# EAGLE design Project-PowerSwitch-Final (EAGLE 7.2.0)

## Sheet 1 of 3
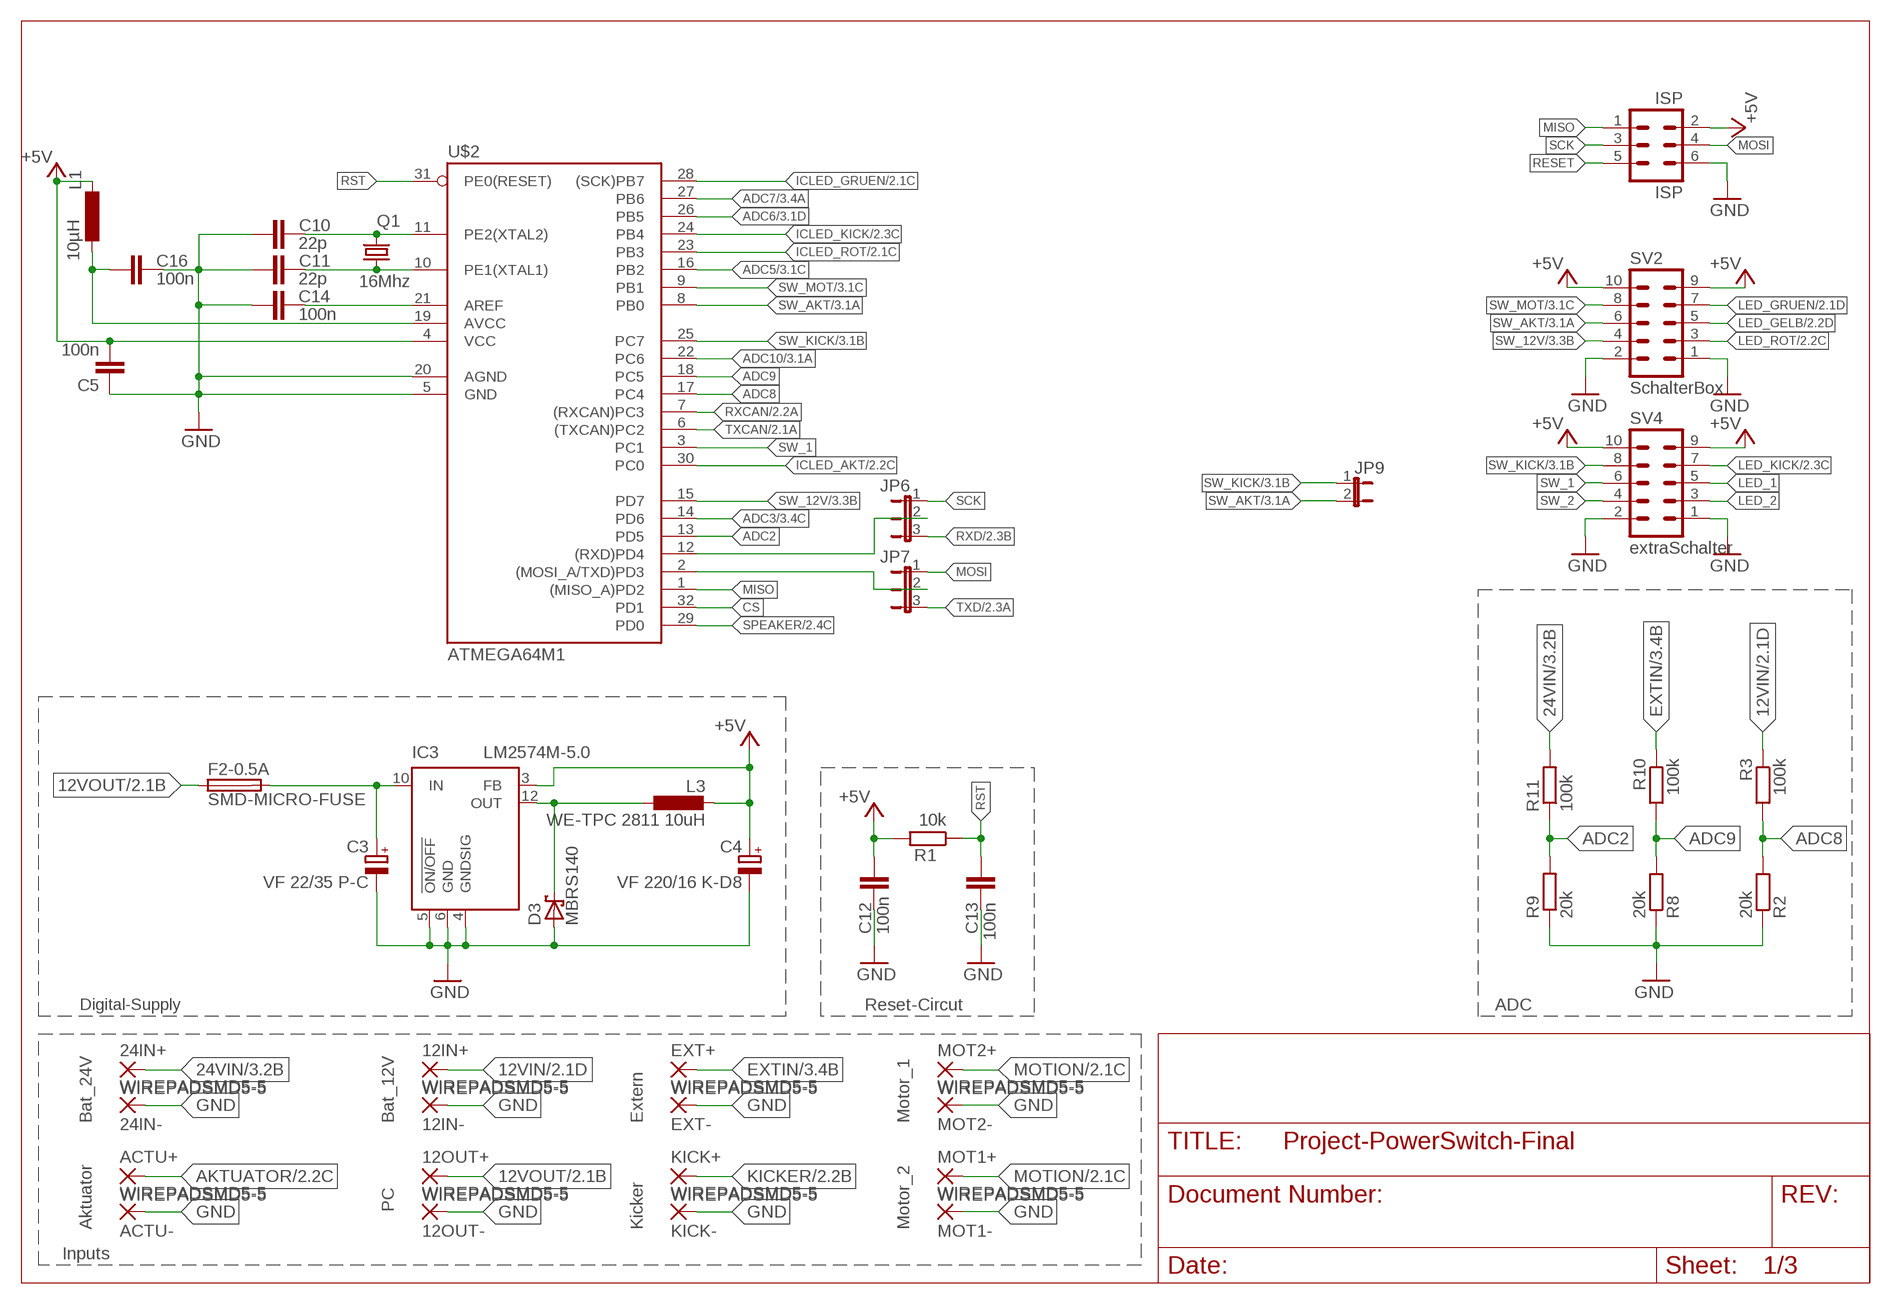
[diagram p0: schematic, sheet 1]

### Parts
12IN+  WIREPADSMD5-5  [5-5]
12IN-  WIREPADSMD5-5  [5-5]
12OUT+  WIREPADSMD5-5  [5-5]
12OUT-  WIREPADSMD5-5  [5-5]
24IN+  WIREPADSMD5-5  [5-5]
24IN-  WIREPADSMD5-5  [5-5]
ACTU+  WIREPADSMD5-5  [5-5]
ACTU-  WIREPADSMD5-5  [5-5]
C3  VF 22/35 P-C  CPOL-EUC  [PANASONIC_C]
C4  VF 220/16 K-D8  CPOL-EUD  [PANASONIC_D]
C5  100n  C-EUC0603K  [C0603K]
C10  22p  C-EUC0603K  [C0603K]
C11  22p  C-EUC0603K  [C0603K]
C12  100n  C-EUC0603K  [C0603K]
C13  100n  C-EUC0603K  [C0603K]
C14  100n  C-EUC0603K  [C0603K]
C16  100n  C-EUC0603K  [C0603K]
D3  MBRS140  SCHOTTKY-DIODESMD  [SMB]
EXT+  WIREPADSMD5-5  [5-5]
EXT-  WIREPADSMD5-5  [5-5]
F2-0.5A  SMD-MICRO-FUSE  [SMD-6,1X2,6]
IC3  LM2574M-5.0  [SO14W]
ISP  ISP  ML6  [ML6]
JP6  JP2E  [JP2]
JP7  JP2E  [JP2]
JP9  JP1E  [JP1]
KICK+  WIREPADSMD5-5  [5-5]
KICK-  WIREPADSMD5-5  [5-5]
L1  10µH  L-EU-0805L0805  [R0805]
L3  WE-TPC 2811 10uH  L-EUWE-TPC  [POWER-CHOKE_WE-TPC]
MOT1+  WIREPADSMD5-5  [5-5]
MOT1-  WIREPADSMD5-5  [5-5]
MOT2+  WIREPADSMD5-5  [5-5]
MOT2-  WIREPADSMD5-5  [5-5]
Q1  16Mhz  CRYTALHC49U-V  [HC49U-V@1]
R1  10k  R-EU_R0805  [R0805]
R2  20k  R-EU_R0805  [R0805]
R3  100k  R-EU_R0805  [R0805]
R8  20k  R-EU_R0805  [R0805]
R9  20k  R-EU_R0805  [R0805]
R10  100k  R-EU_R0805  [R0805]
R11  100k  R-EU_R0805  [R0805]
SV2  SchalterBox  ML10  [ML10]
SV4  extraSchalter  ML10  [ML10]
U$2  ATMEGA64M1  [TQFP32-08]

### Nets
12VIN: 12IN+.P$1(P) R3.1 ; also sheet 2,3
12VOUT: 12OUT+.P$1(P) F2-0.5A.1 ; also sheet 2,3
24VIN: 24IN+.P$1(P) R11.2 ; also sheet 3
+5V: C4.+ C5.2 C12.2 IC3.3(FB) ISP.2 L1.2 L3.2 R1.2 SV2.9 SV2.10 SV4.9 SV4.10 U$2.4(VCC) ; also sheet 2
ADC2: R9.2 R11.1 U$2.13(PD5)
ADC3: U$2.14(PD6) ; also sheet 3
ADC5: U$2.16(PB2) ; also sheet 3
ADC6: U$2.26(PB5) ; also sheet 3
ADC7: U$2.27(PB6) ; also sheet 3
ADC8: R2.2 R3.2 U$2.17(PC4)
ADC9: R8.2 R10.2 U$2.18(PC5)
ADC10: U$2.22(PC6) ; also sheet 3
AKTUATOR: ACTU+.P$1(P) ; also sheet 2,3
CS: U$2.32(PD1)
EXTIN: EXT+.P$1(P) R10.1 ; also sheet 3
GND: 12IN-.P$1(P) 12OUT-.P$1(P) 24IN-.P$1(P) ACTU-.P$1(P) C3.- C4.- C5.1 C10.1 C11.1 C12.1 C13.1 C14.1 C16.2 D3.A EXT-.P$1(P) IC3.4(GNDSIG) IC3.5(!ON/OFF) IC3.6(GND) ISP.6 KICK-.P$1(P) MOT1-.P$1(P) MOT2-.P$1(P) R2.1 R8.1 R9.1 SV2.1 SV2.2 SV4.1 SV4.2 U$2.5(GND) U$2.20(AGND) ; also sheet 2,3
ICLED_AKT: U$2.30(PC0) ; also sheet 2
ICLED_GRUEN: U$2.28((SCK)PB7) ; also sheet 2
ICLED_KICK: U$2.24(PB4) ; also sheet 2
ICLED_ROT: U$2.23(PB3) ; also sheet 2
KICKER: KICK+.P$1(P) ; also sheet 2,3
LED_1: SV4.5
LED_2: SV4.3
LED_GELB: SV2.5 ; also sheet 2
LED_GRUEN: SV2.7 ; also sheet 2
LED_KICK: SV4.7 ; also sheet 2
LED_ROT: SV2.3 ; also sheet 2
MISO: ISP.1 U$2.1((MISO_A)PD2)
MOSI: ISP.4 JP7.1
MOTION: MOT1+.P$1(P) MOT2+.P$1(P) ; also sheet 2,3
N$10: C10.2 Q1.2 U$2.11(PE2(XTAL2))
N$11: C11.2 Q1.1 U$2.10(PE1(XTAL1))
N$13: C14.2 U$2.21(AREF)
N$14: C16.1 L1.1 U$2.19(AVCC)
N$16: JP6.2 U$2.12((RXD)PD4)
N$17: JP7.2 U$2.2((MOSI_A/TXD)PD3)
N$22: C3.+ F2-0.5A.2 IC3.10(IN)
N$64: D3.C IC3.12(OUT) L3.1
RESET: ISP.5
RST: C13.2 R1.1 U$2.31(PE0(RESET))
RXCAN: U$2.7((RXCAN)PC3) ; also sheet 2
RXD: JP6.3 ; also sheet 2
SCK: ISP.3 JP6.1
SPEAKER: U$2.29(PD0) ; also sheet 2
SW_1: SV4.6 U$2.3(PC1)
SW_2: SV4.4
SW_12V: SV2.4 U$2.15(PD7) ; also sheet 3
SW_AKT: JP9.2 SV2.6 U$2.8(PB0) ; also sheet 3
SW_KICK: JP9.1 SV4.8 U$2.25(PC7) ; also sheet 3
SW_MOT: SV2.8 U$2.9(PB1) ; also sheet 3
TXCAN: U$2.6((TXCAN)PC2) ; also sheet 2
TXD: JP7.3 ; also sheet 2

### Notes on the sheet
- Digital-Supply | Reset-Circut | ADC
- Bat_24V | Bat_12V | Extern | Motor_1
- PC
- Aktuator | Kicker | Motor_2
- Inputs

## Sheet 2 of 3
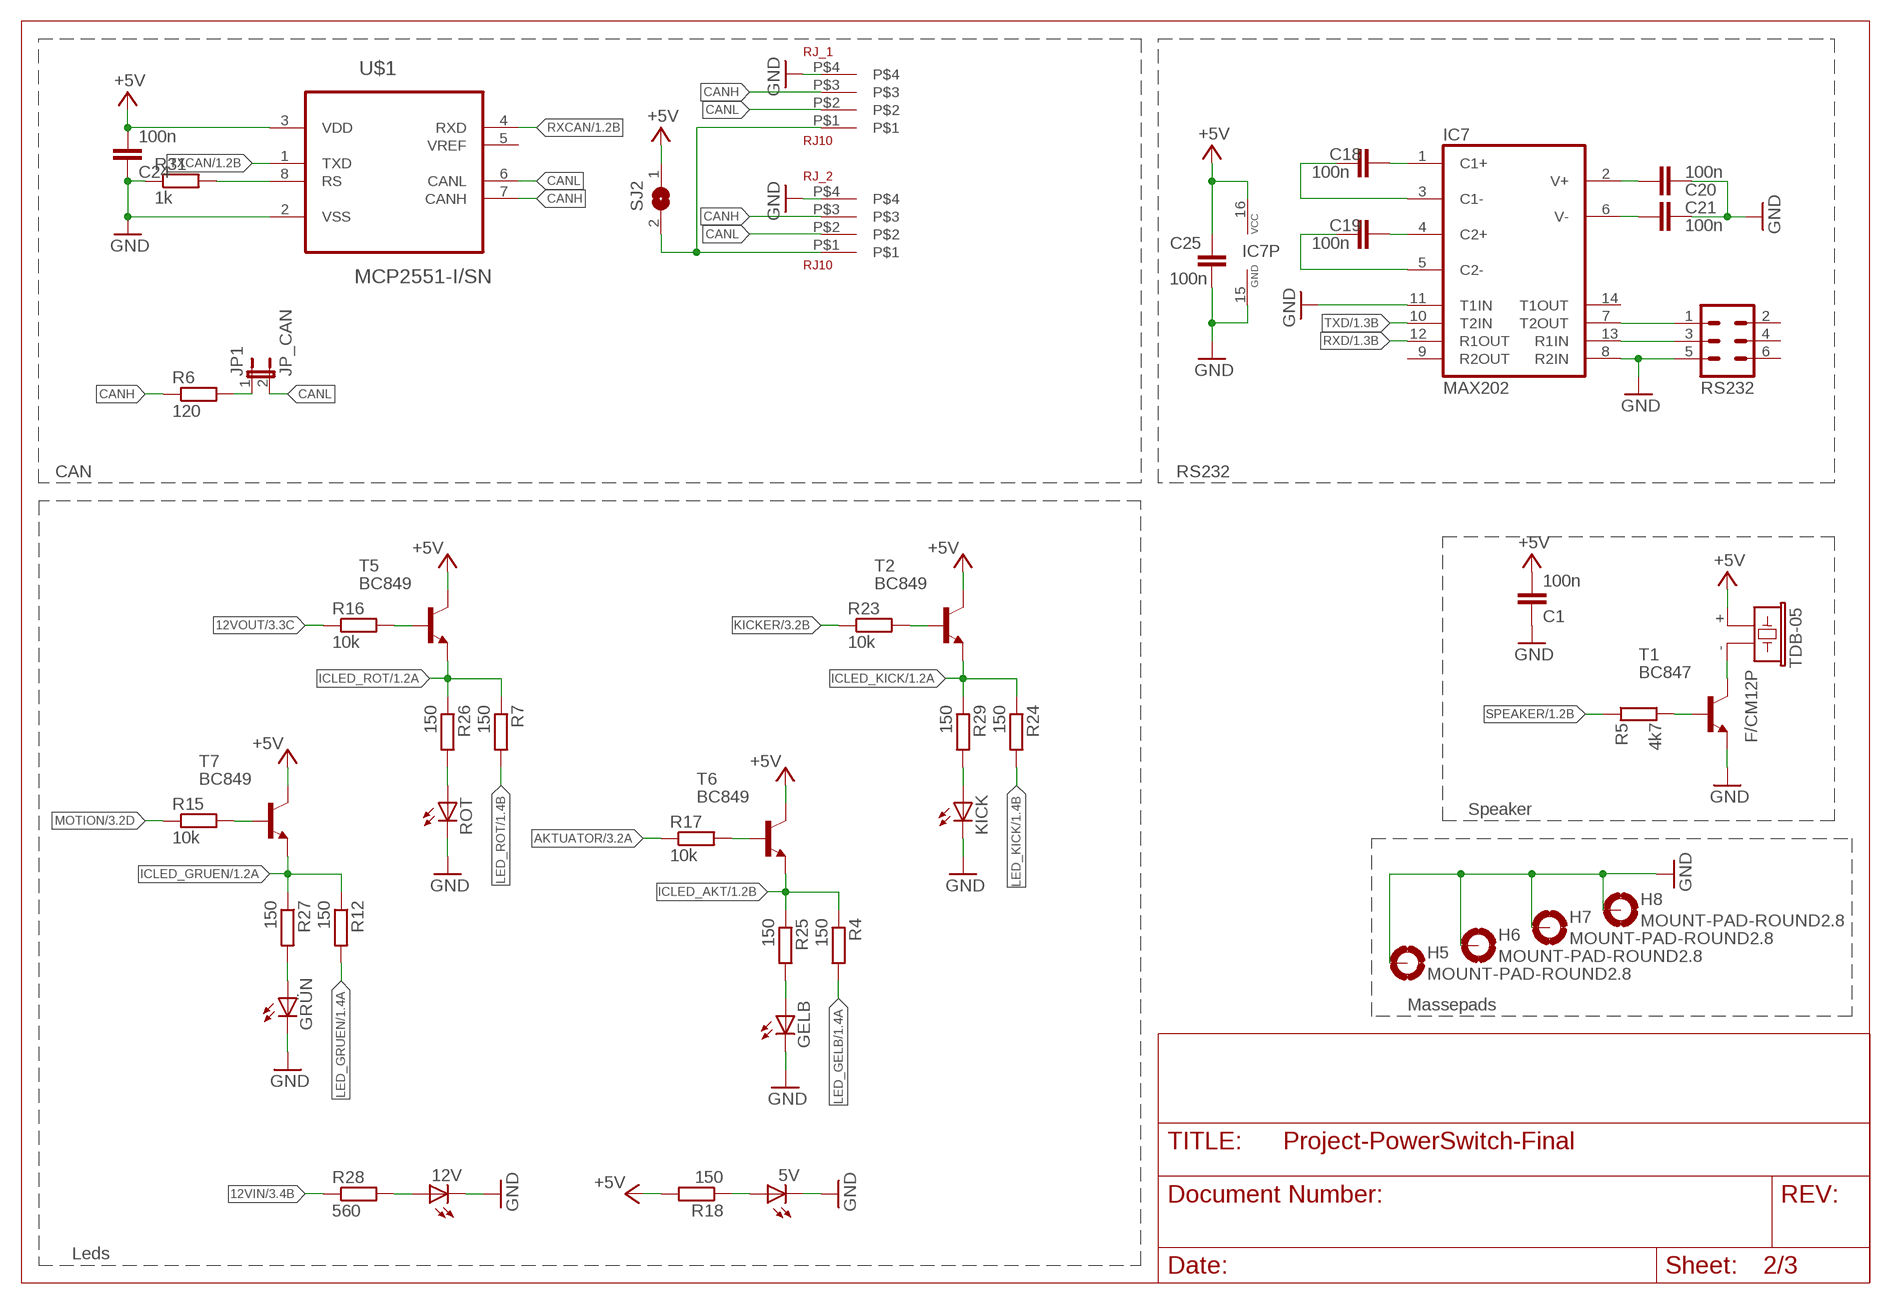
[diagram p1: schematic, sheet 2]

### Parts
5V  LEDCHIPLED_0805  [CHIPLED_0805]
12V  LEDCHIPLED_0805  [CHIPLED_0805]
C1  100n  C-EUC0603  [C0603]
C18  100n  C-EUC0603K  [C0603K]
C19  100n  C-EUC0603K  [C0603K]
C20  100n  C-EUC0603K  [C0603K]
C21  100n  C-EUC0603K  [C0603K]
C24  100n  C-EUC0603  [C0603]
C25  100n  C-EUC0603K  [C0603K]
GELB  LEDCHIPLED_0805  [CHIPLED_0805]
GRÜN  LEDCHIPLED_0805  [CHIPLED_0805]
H5  MOUNT-PAD-ROUND2.8  [2,8-PAD]
H6  MOUNT-PAD-ROUND2.8  [2,8-PAD]
H7  MOUNT-PAD-ROUND2.8  [2,8-PAD]
H8  MOUNT-PAD-ROUND2.8  [2,8-PAD]
IC7  MAX202  MAX3232CSE  [SO16]
JP1  JP_CAN  JP1E  [JP1]
KICK  LEDCHIPLED_0805  [CHIPLED_0805]
R4  150  R-EU_R0805  [R0805]
R5  4k7  R-EU_R0805  [R0805]
R6  120  R-EU_M0805  [M0805]
R7  150  R-EU_R0805  [R0805]
R12  150  R-EU_R0805  [R0805]
R15  10k  R-EU_R0805  [R0805]
R16  10k  R-EU_R0805  [R0805]
R17  10k  R-EU_R0805  [R0805]
R18  150  R-EU_R0805  [R0805]
R23  10k  R-EU_R0805  [R0805]
R24  150  R-EU_R0805  [R0805]
R25  150  R-EU_R0805  [R0805]
R26  150  R-EU_R0805  [R0805]
R27  150  R-EU_R0805  [R0805]
R28  560  R-EU_R0805  [R0805]
R29  150  R-EU_R0805  [R0805]
R31  1k  R-EU_R0805  [R0805]
RJ_1  RJ10  [RJ10]
RJ_2  RJ10  [RJ10]
ROT  LEDCHIPLED_0805  [CHIPLED_0805]
RS232  ML6  [ML6]
SJ2  SJ  [SJ]
T1  BC847  [SOT23]
T2  BC849  [SOT23]
T5  BC849  [SOT23]
T6  BC849  [SOT23]
T7  BC849  [SOT23]
TDB-05  F/CM12P  [F/CM12P]
U$1  MCP2551-I/SN  [SOIC127P600X175-8N]

### Nets
12VIN: R28.1 ; also sheet 1,3
12VOUT: R16.1 ; also sheet 1,3
+5V: C1.2 C24.2 C25.1 IC7.16(VCC) R18.2 SJ2.1 T2.3(C) T5.3(C) T6.3(C) T7.3(C) TDB-05.+ U$1.3(VDD) ; also sheet 1
AKTUATOR: R17.1 ; also sheet 1,3
CANH: R6.1 RJ_1.P$3 RJ_2.P$3 U$1.7(CANH)
CANL: JP1.2 RJ_1.P$2 RJ_2.P$2 U$1.6(CANL)
GND: 5V.C 12V.C C1.1 C20.2 C21.2 C24.1 C25.2 GELB.C GRÜN.C H5.B2,8(MOUNT) H6.B2,8(MOUNT) H7.B2,8(MOUNT) H8.B2,8(MOUNT) IC7.8(R2IN) IC7.11(T1IN) IC7.15(GND) KICK.C R31.1 RJ_1.P$4 RJ_2.P$4 ROT.C RS232.5 T1.2(E) U$1.2(VSS) ; also sheet 1,3
ICLED_AKT: R4.1 R25.1 T6.2(E) ; also sheet 1
ICLED_GRUEN: R12.1 R27.1 T7.2(E) ; also sheet 1
ICLED_KICK: R24.1 R29.1 T2.2(E) ; also sheet 1
ICLED_ROT: R7.1 R26.1 T5.2(E) ; also sheet 1
KICKER: R23.1 ; also sheet 1,3
LED_GELB: R4.2 ; also sheet 1
LED_GRUEN: R12.2 ; also sheet 1
LED_KICK: R24.2 ; also sheet 1
LED_ROT: R7.2 ; also sheet 1
MOTION: R15.1 ; also sheet 1,3
N$1: R5.2 T1.1(B)
N$2: RJ_1.P$1 RJ_2.P$1 SJ2.2
N$4: R23.2 T2.1(B)
N$5: KICK.A R29.2
N$6: R31.2 U$1.8(RS)
N$7: JP1.1 R6.2
N$8: GELB.A R25.2
N$9: R26.2 ROT.A
N$15: C18.2 IC7.1(C1+)
N$18: C19.2 IC7.4(C2+)
N$20: T1.3(C) TDB-05.-
N$21: GRÜN.A R27.2
N$24: 12V.A R28.2
N$35: C18.1 IC7.3(C1-)
N$36: C19.1 IC7.5(C2-)
N$37: C20.1 IC7.2(V+)
N$38: C21.1 IC7.6(V-)
N$40: IC7.13(R1IN) RS232.3
N$41: IC7.7(T2OUT) RS232.1
N$102: R16.2 T5.1(B)
N$104: R17.2 T6.1(B)
N$106: R15.2 T7.1(B)
N$108: 5V.A R18.1
RXCAN: U$1.4(RXD) ; also sheet 1
RXD: IC7.12(R1OUT) ; also sheet 1
SPEAKER: R5.1 ; also sheet 1
TXCAN: U$1.1(TXD) ; also sheet 1
TXD: IC7.10(T2IN) ; also sheet 1
Unconnected: IC7.9(R2OUT) IC7.14(T1OUT) RS232.2 RS232.4 RS232.6 U$1.5(VREF)

### Notes on the sheet
- CAN | RS232
- Speaker
- Massepads
- Leds

## Sheet 3 of 3
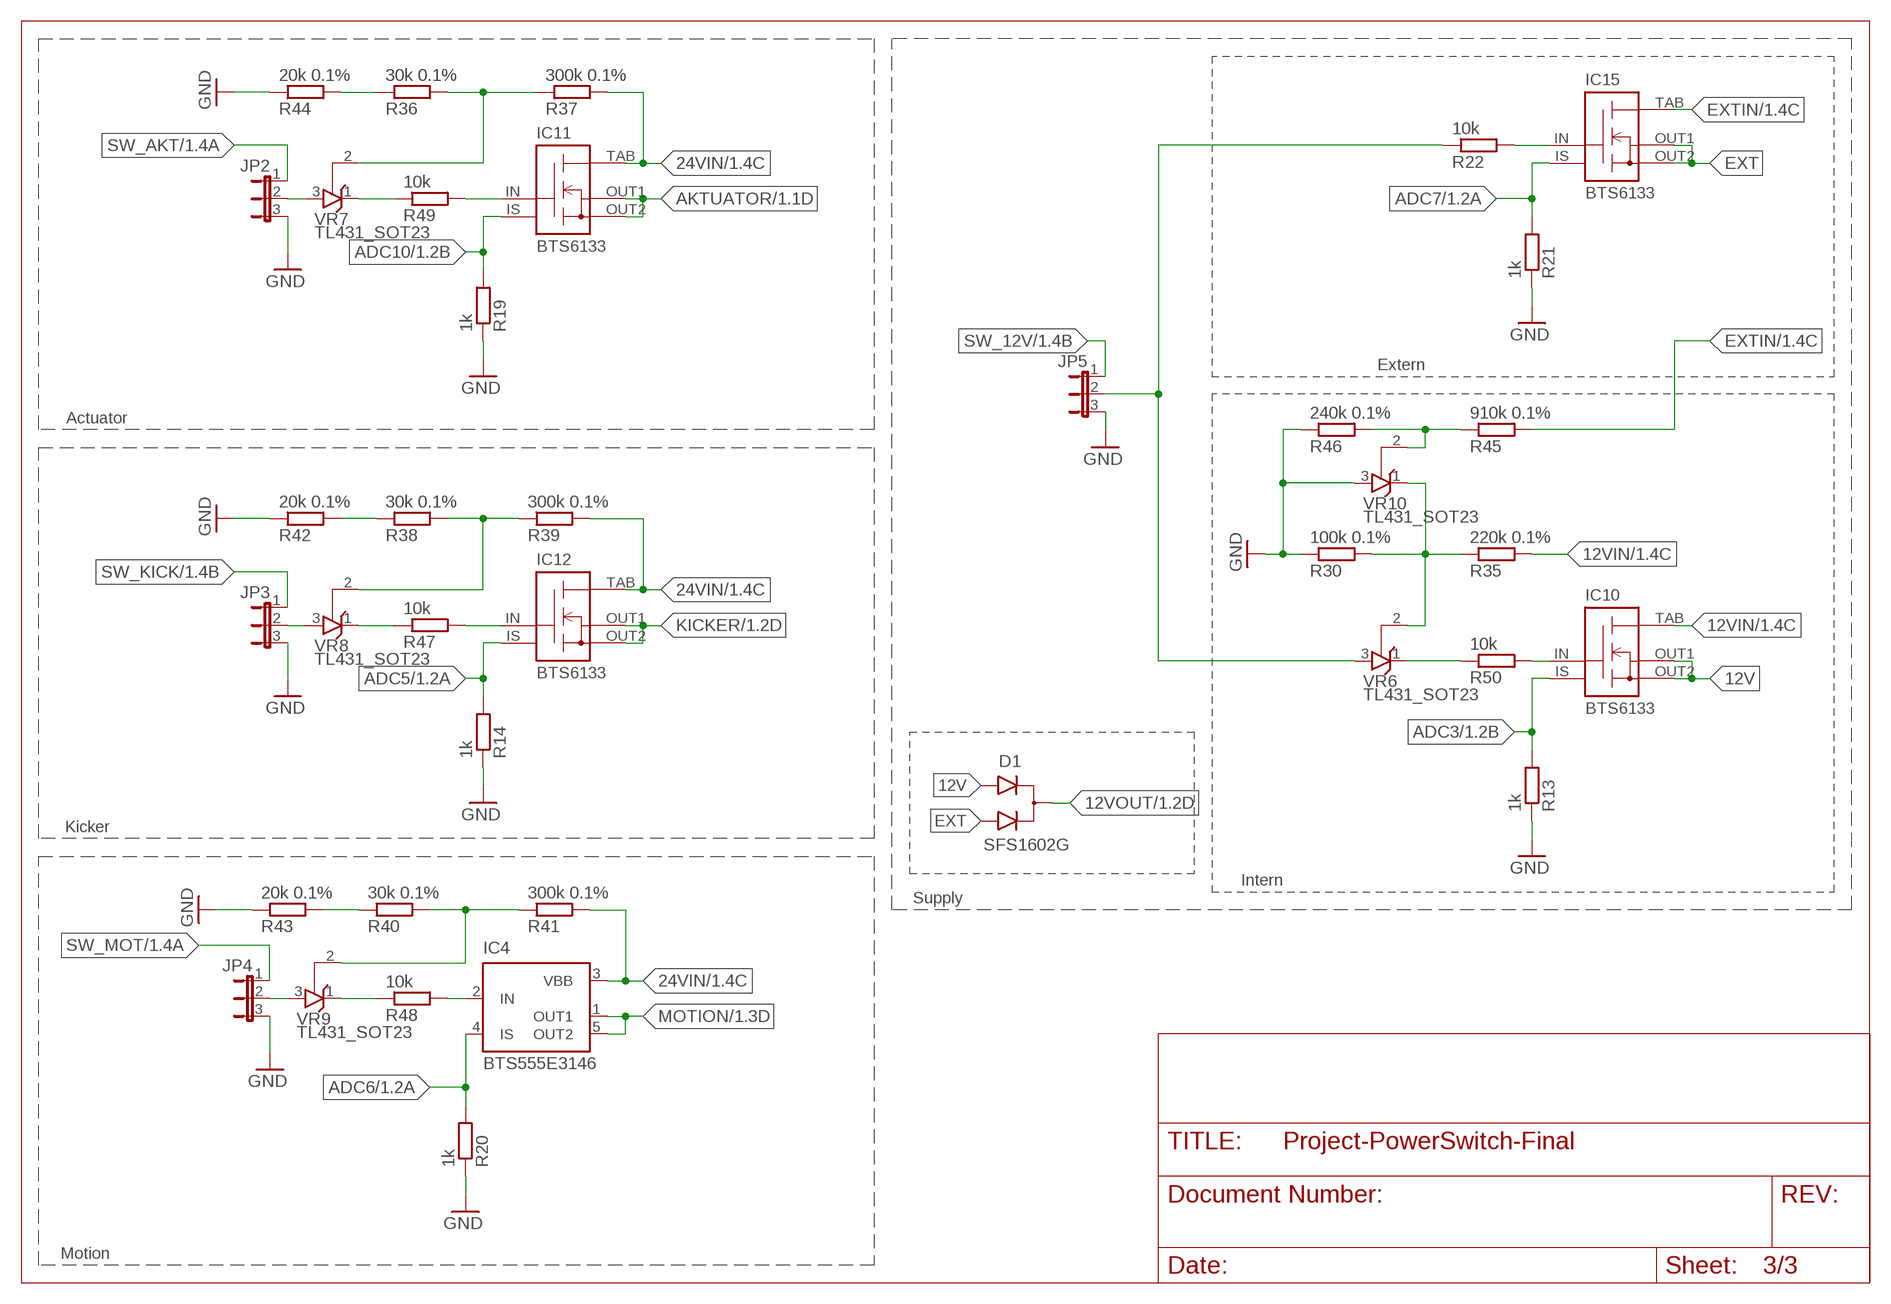
[diagram p2: schematic, sheet 3]

### Parts
D1  SFS1602G  SFS160G  [D2PAK]
IC4  BTS555E3146  [TO220-52]
IC10  BTS6133  [TO252-51]
IC11  BTS6133  [TO252-51]
IC12  BTS6133  [TO252-51]
IC15  BTS6133  [TO252-51]
JP2  JP2E  [JP2]
JP3  JP2E  [JP2]
JP4  JP2E  [JP2]
JP5  JP2E  [JP2]
R13  1k  R-EU_R0805  [R0805]
R14  1k  R-EU_R0805  [R0805]
R19  1k  R-EU_R0805  [R0805]
R20  1k  R-EU_R0805  [R0805]
R21  1k  R-EU_R0805  [R0805]
R22  10k  R-EU_R0805  [R0805]
R30  100k 0.1%  R-EU_R0805  [R0805]
R35  220k 0.1%  R-EU_R0805  [R0805]
R36  30k 0.1%  R-EU_R0805  [R0805]
R37  300k 0.1%  R-EU_R0805  [R0805]
R38  30k 0.1%  R-EU_R0805  [R0805]
R39  300k 0.1%  R-EU_R0805  [R0805]
R40  30k 0.1%  R-EU_R0805  [R0805]
R41  300k 0.1%  R-EU_R0805  [R0805]
R42  20k 0.1%  R-EU_R0805  [R0805]
R43  20k 0.1%  R-EU_R0805  [R0805]
R44  20k 0.1%  R-EU_R0805  [R0805]
R45  910k 0.1%  R-EU_R0805  [R0805]
R46  240k 0.1%  R-EU_R0805  [R0805]
R47  10k  R-EU_R0805  [R0805]
R48  10k  R-EU_R0805  [R0805]
R49  10k  R-EU_R0805  [R0805]
R50  10k  R-EU_R0805  [R0805]
VR6  TL431_SOT23  [SOT23]
VR7  TL431_SOT23  [SOT23]
VR8  TL431_SOT23  [SOT23]
VR9  TL431_SOT23  [SOT23]
VR10  TL431_SOT23  [SOT23]

### Nets
12V: D1.P$1 IC10.OUT1(OUT) IC10.OUT2(OUT)
12VIN: IC10.TAB(VBB) R35.2 ; also sheet 1,2
12VOUT: D1.P$3 ; also sheet 1,2
24VIN: IC4.3(VBB) IC11.TAB(VBB) IC12.TAB(VBB) R37.2 R39.2 R41.2 ; also sheet 1
ADC3: IC10.IS R13.2 ; also sheet 1
ADC5: IC12.IS R14.2 ; also sheet 1
ADC6: IC4.4(IS) R20.2 ; also sheet 1
ADC7: IC15.IS R21.2 ; also sheet 1
ADC10: IC11.IS R19.2 ; also sheet 1
AKTUATOR: IC11.OUT1(OUT) IC11.OUT2(OUT) ; also sheet 1,2
EXT: D1.P$2 IC15.OUT1(OUT) IC15.OUT2(OUT)
EXTIN: IC15.TAB(VBB) R45.2 ; also sheet 1
GND: JP2.3 JP3.3 JP4.3 JP5.3 R13.1 R14.1 R19.1 R20.1 R21.1 R30.1 R42.1 R43.1 R44.1 R46.1 VR10.3(A) ; also sheet 1,2
KICKER: IC12.OUT1(OUT) IC12.OUT2(OUT) ; also sheet 1,2
MOTION: IC4.1(OUT1) IC4.5(OUT2) ; also sheet 1,2
N$3: IC15.IN R22.2
N$12: JP2.2 VR7.3(A)
N$19: JP4.2 VR9.3(A)
N$23: JP3.2 VR8.3(A)
N$25: JP5.2 R22.1 VR6.3(A)
N$28: IC10.IN R50.2
N$33: R30.2 R35.1 VR6.2(R) VR10.1(C)
N$39: R49.1 VR7.1(C)
N$42: R36.2 R37.1 VR7.2(R)
N$43: IC12.IN R47.2
N$44: R38.2 R39.1 VR8.2(R)
N$45: R40.2 R41.1 VR9.2(R)
N$46: IC4.2(IN) R48.2
N$47: R38.1 R42.2
N$48: R40.1 R43.2
N$49: R36.1 R44.2
N$50: R45.1 R46.2 VR10.2(R)
N$51: R47.1 VR8.1(C)
N$52: R48.1 VR9.1(C)
N$53: IC11.IN R49.2
N$54: R50.1 VR6.1(C)
SW_12V: JP5.1 ; also sheet 1
SW_AKT: JP2.1 ; also sheet 1
SW_KICK: JP3.1 ; also sheet 1
SW_MOT: JP4.1 ; also sheet 1

### Notes on the sheet
- Extern
- Actuator
- Kicker
- Intern
- Supply
- Motion

## Library data of the parts
5V 12V GELB GRÜN KICK ROT = led:LED: LED OSRAM: - CHIPLED LG R971, LG N971, LY N971, LG Q971, LY Q971, LO R971, LY R971 LH N974, LH R974 LS Q976, LO Q976, LY Q976 LO Q996 - Hyper CHIPLED LW Q18S LB Q993, LB Q99A, LB R99A - SideLED LS A670, LO A670, LY A670, LG A670, LP A670 LB A673, LV A673, LT A673, LW A673 LH A674 LY A675 LS A676, LA A676, LO A676, LY A676, LW A676 LS A679, LY A679, LG A679 - Hyper Micro SIDELED® LS Y876, LA Y876, LO Y876, LY Y876 LT Y87S - SmartLED LW L88C, LW L88S LB L89C, LB L89S, LG L890 LS L89K, LO L89K, LY L89K LS L896, LA L896, LO L896, LY L896 - TOPLED LS T670, LO T670, LY T670, LG T670, LP T670 LSG T670, LSP T670, LSY T670, LOP T670, LYG T670 LG T671, LOG T671, LSG T671 LB T673, LV T673, LT T673, LW T673 LH T674 LS T676, LA T676, LO T676, LY T676, LB T676, LH T676, LSB T676, LW T676 LB T67C, LV T67C, LT T67C, LS T67K, LO T67K, LY T67K, LW E67C LS E67B, LA E67B, LO E67B, LY E67B, LB E67C, LV E67C, LT E67C LW T67C LS T679, LY T679, LG T679 LS T770, LO T770, LY T770, LG T770, LP T770 LB T773, LV T773, LT T773, LW T773 LH T774 LS E675, LA E675, LY E675, LS T675 LS T776, LA T776, LO T776, LY T776, LB T776 LHGB T686 LT T68C, LB T68C - Hyper Mini TOPLED® LB M676 - Mini TOPLED Santana® LG M470 LS M47K, LO M47K, LY M47K Source: http://www.osram.convergy.de LUXEON: - LUMILED® LXK2-PW12-R00, LXK2-PW12-S00, LXK2-PW14-U00, LXK2-PW14-V00 LXK2-PM12-R00, LXK2-PM12-S00, LXK2-PM14-U00 LXK2-PE12-Q00, LXK2-PE12-R00, LXK2-PE12-S00, LXK2-PE14-T00, LXK2-PE14-U00 LXK2-PB12-K00, LXK2-PB12-L00, LXK2-PB12-M00, LXK2-PB14-N00, LXK2-PB14-P00, LXK2-PB14-Q00 LXK2-PR12-L00, LXK2-PR12-M00, LXK2-PR14-Q00, LXK2-PR14-R00 LXK2-PD12-Q00, LXK2-PD12-R00, LXK2-PD12-S00 LXK2-PH12-R00, LXK2-PH12-S00 LXK2-PL12-P00, LXK2-PL12-Q00, LXK2-PL12-R00 Source: www.luxeon.com KINGBRIGHT: KA-3528ASYC Source: www.kingbright.com
12IN+ 12IN- 12OUT+ 12OUT- 24IN+ 24IN- ACTU+ ACTU- EXT+ EXT- KICK+ KICK- MOT1+ MOT1- MOT2+ MOT2- = mywirepad:WIREPAD: Wire PAD connect wire on PCB
C1 C5 C10-C14 C16 C18-C21 C24 C25 = rcl:C-EU: CAPACITOR, European symbol
C3 C4 = rcl:CPOL-EU: POLARIZED CAPACITOR, European symbol
D1 = ownParts:SFS160*G
D3 = diode:SCHOTTKY-DIODE: Schottky Diode
F2-0.5A = f-lf-omniblok-s:SMD-MICRO-FUSE
H5-H8 = holes:MOUNT-PAD-ROUND: MOUNTING PAD, round
IC3 = linear:LM2574?-*: SIMPLE SWITCHER 0.5A Step-Down Voltage Regulator Source: http://cache.national.com/ds/LM/LM2574.pdf
IC4 = micro-siemens:BTS555: Smart Highside High Current Power Switch PROFET® Source: http://www.infineon.com/upload/Document/cmc_upload/documents/011/8726/Datasheet_BTS555.pdf; OC_FARNELL: unknown; OC_NEWARK: unknown
IC7 = maxim:MAX3232*: True RS-232 Transceivers 3.0V to 5.5V, Low-Power up to 1Mbps, Using Four 0.1µF External Capacitors Source: http://pdfserv.maxim-ic.com/en/ds/MAX3222-MAX3241.pdf; MPN: MAX3232CSE; OC_FARNELL: 9725490; OC_NEWARK: 90C2890
IC10-IC12 IC15 = BTS443P:BTS6133
ISP RS232 = con-ml:ML6: HARTING; OC_FARNELL: unknown; OC_NEWARK: unknown
JP1 JP9 = jumper:JP1E: JUMPER
JP2-JP7 = jumper:JP2E: JUMPER
L1 = myrcl:L-EU-0805
L3 = rcl:L-EU: INDUCTOR, European symbol
Q1 = crystal:CRYTAL: CRYSTAL
R1-R31 R35-R50 = rcl:R-EU_: RESISTOR, European symbol
RJ_1 RJ_2 = ownParts:RJ10
SJ2 = jumper:SJ: SMD solder JUMPER
SV2 SV4 = con-ml:ML10: HARTING; OC_FARNELL: unknown; OC_NEWARK: unknown
T1 = transistor:BC847: NPN TRANSISTOR
T2 T5-T7 = transistor:BC849: NPN TRANSISTOR
TDB-05 = buzzer:F/CM12P: BUZZER Source: Buerklin; OC_FARNELL: unknown; OC_NEWARK: unknown
U$1 = Microchip-MCP2551-I_SN:MCP2551-I/SN: High-Speed CAN Transceiver; MPN: MCP2551-I/SN; OC_FARNELL: 9758569; OC_NEWARK: 69K7604; PACKAGE: SOIC-8; SUPPLIER: Microchip
U$2 = atmega16m1-32m1-64m1:ATMEGA64M1
VR6-VR10 = 1_USER:TL431

## Board
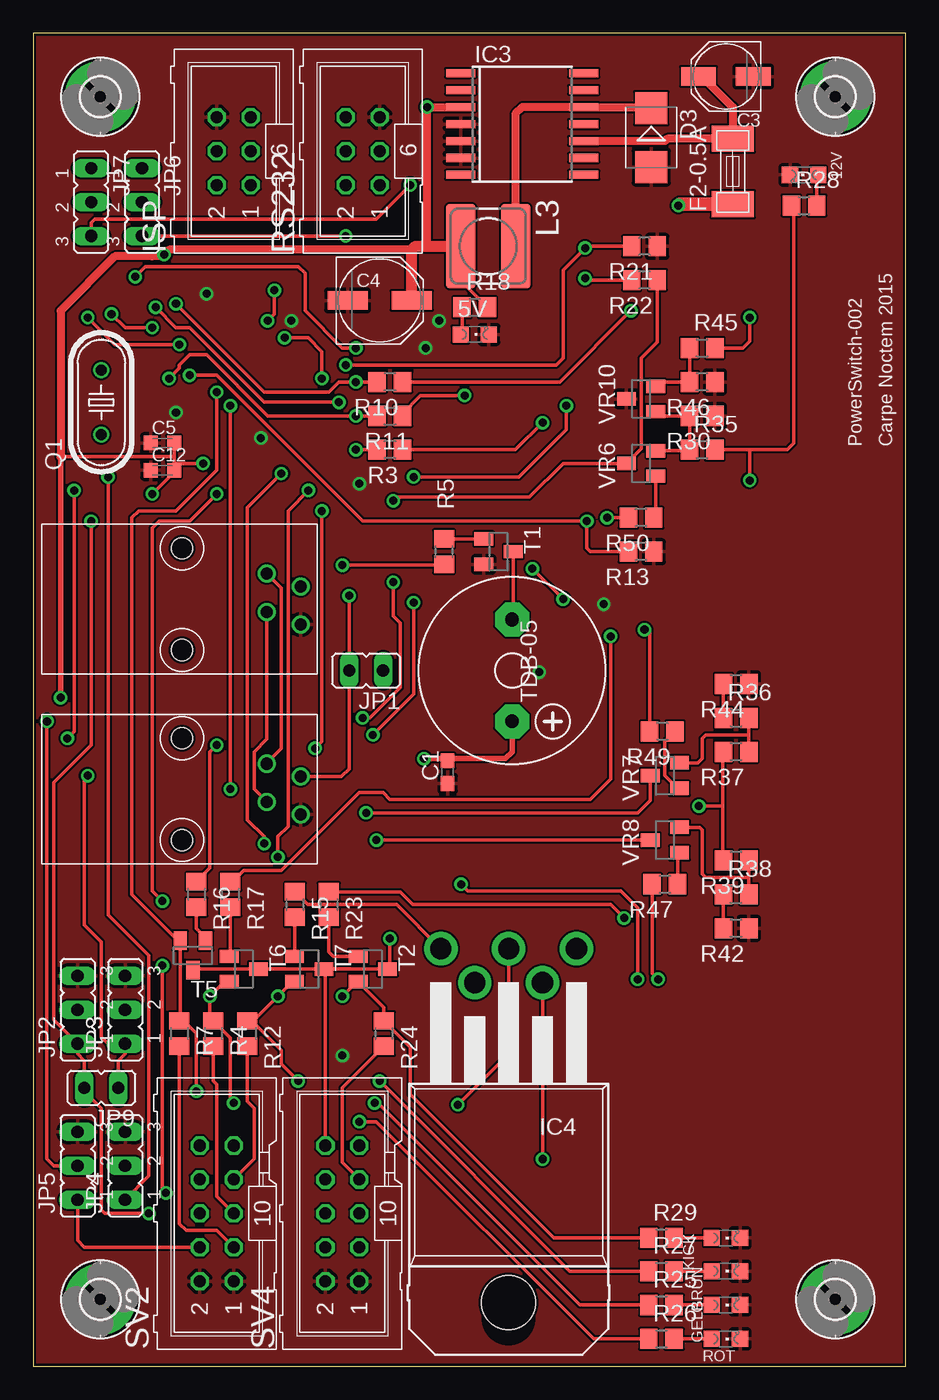
[diagram p3: board, top side]
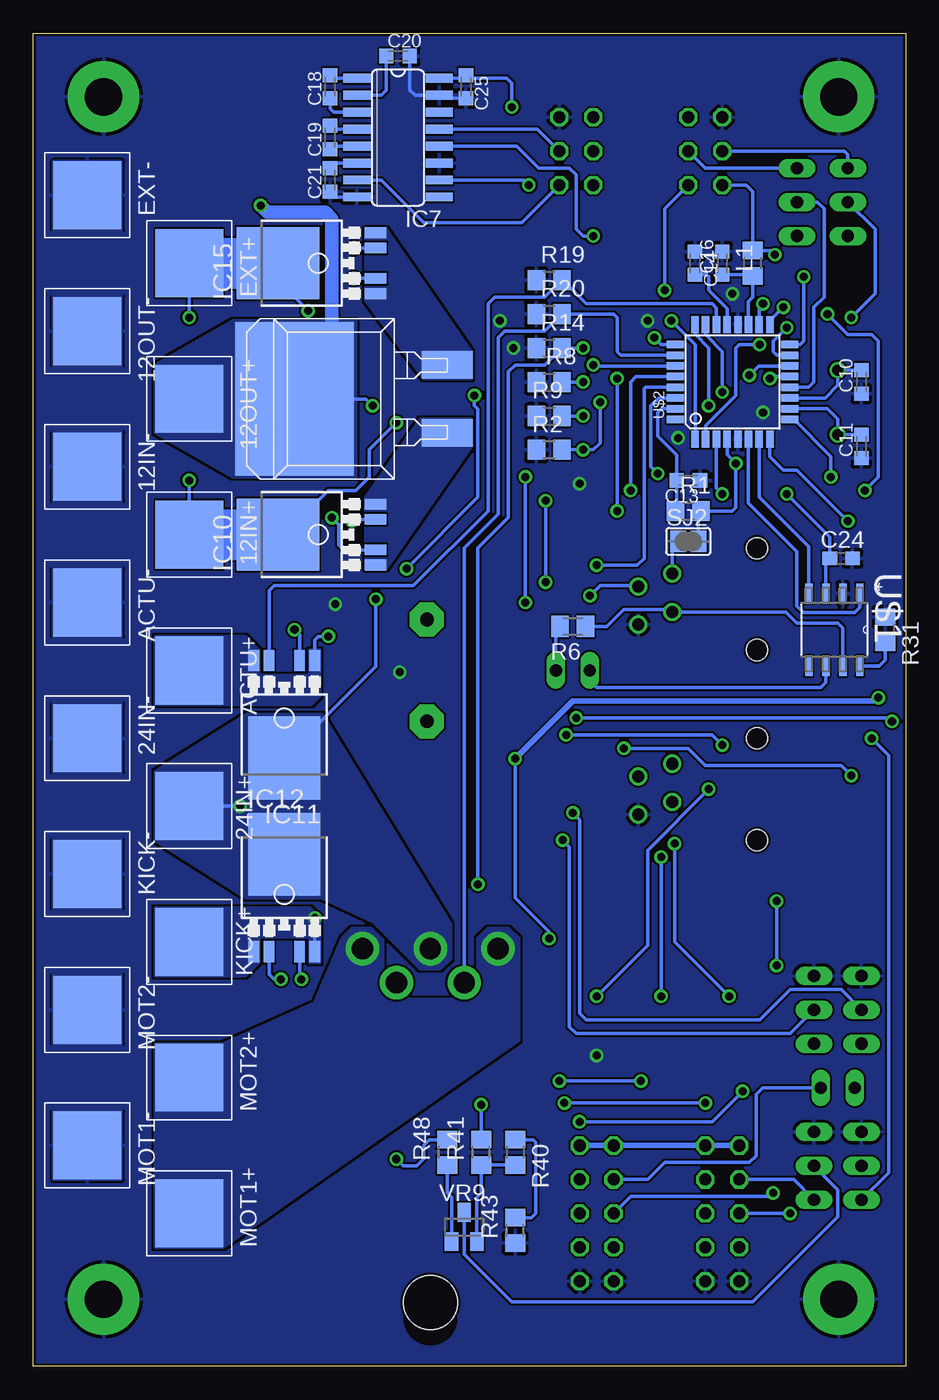
[diagram p4: board, bottom side, seen from below]

Size 65.25 x 99.75 mm. Coordinates in mm from the lower left corner, seen from the top.
Outline: 0,0 65.25,0 65.25,99.75 0,99.75 0,0
Copper layers (1+2*15+16): Top 0.035mm / dielectric 0.36mm / Route2 0.018mm / dielectric 0.71mm / Route15 0.018mm / dielectric 0.36mm / Bottom 0.035mm
Design rules "qp_designrules_6mil": minimum track width 6mil, minimum drill 0.3mm, track to track 6mil, track to pad 6mil, pad to pad 6mil, via to via 6mil, smd to smd 6mil, copper to edge 8mil, drill to drill 10mil, minimum pad ring 8mil, minimum via ring 8mil, stop-mask expansion 2mil, vias tented up to drill 16mil, thermal gap 10mil

### Footprints (pad centres in the part's own frame; a part is rotated, then mirrored left to right if it is on the bottom)
CHIPLED_0805 = smd 1.2 x 1.2: A 0,-1.05; C 0,1.05
5-5 = smd 5.08 x 5.08: P$1 0,0
C0603 = smd 1.1 x 1: 1 -0.85,0; 2 0.85,0
PANASONIC_C = smd 2.6 x 1.4: + 2.05,0; - -2.05,0
PANASONIC_D = smd 3 x 1.4: + 2.4,0; - -2.4,0
C0603K = smd 1.05 x 1.08: 1 -0.875,0; 2 0.875,0
D2PAK = smd 2.08 x 3.81: P$1 -2.54,-6.985; P$2 2.54,-6.985 | smd 11.5 x 8.89: P$3 0,4.445
SMB = smd 2.4 x 2.4: A 2.2,0; C -2.2,0
SMD-6,1X2,6 = smd 1.96 x 3.15: 1 -2.45,0; 2 2.45,0
2,8-PAD = drill 2.8 pad 5.334: B2,8 0,0
SO14W = smd 0.6 x 2.2: 1 -3.81,-4.6; 2 -2.54,-4.6; 3 -1.27,-4.6; 4 0,-4.6; 5 1.27,-4.6; 6 2.54,-4.6; 7 3.81,-4.6; 8 3.81,4.6; 9 2.54,4.6; 10 1.27,4.6; 11 0,4.6; 12 -1.27,4.6; 13 -2.54,4.6; 14 -3.81,4.6
TO220-52 = drill 1.6 pad 2.5: 1 -5.08,-30.48; 2 -2.54,-27.94; 3 0,-30.48; 4 2.54,-27.94; 5 5.08,-30.48 | hole 4.05: 0,-4
SO16 = smd 0.66 x 2.032: 1 -4.445,-3.073; 2 -3.175,-3.073; 3 -1.905,-3.073; 4 -0.635,-3.073; 5 0.635,-3.073; 6 1.905,-3.073; 7 3.175,-3.073; 8 4.445,-3.073; 9 4.445,3.073; 10 3.175,3.073; 11 1.905,3.073; 12 0.635,3.073; 13 -0.635,3.073; 14 -1.905,3.073; 15 -3.175,3.073; 16 -4.445,3.073
TO252-51 = smd 0.8 x 1.6: IN -1.14,-4.8; IS 1.14,-4.8; OUT1 -2.28,-4.8; OUT2 2.28,-4.8 | smd 5.4 x 6.2: TAB 0,2.5
ML6 = drill 0.914 octagon: 1 -2.54,-1.27; 2 -2.54,1.27; 3 0,-1.27; 4 0,1.27; 5 2.54,-1.27; 6 2.54,1.27
JP1 = drill 0.914 long: 1 0,-1.27; 2 0,1.27
JP2 = drill 0.914 long: 1 -2.54,0; 2 0,0; 3 2.54,0
R0805 = smd 1.3 x 1.5: 1 -0.95,0; 2 0.95,0
POWER-CHOKE_WE-TPC = smd 6.3 x 2.2: 1 0,2.05; 2 0,-2.05
HC49U-V@1 = drill 0.813: 1 -2.413,0; 2 2.413,0
M0805 = smd 1.3 x 1.6: 1 -0.95,0; 2 0.95,0
RJ10 = drill 0.9: P$1 -1.905,6.55; P$2 -0.953,9.09; P$3 0.953,6.55; P$4 1.905,9.09 | hole 1.59: -3.81,0.2; 3.81,0.2
SJ = smd 1.168 x 1.6: 1 -0.762,0; 2 0.762,0
ML10 = drill 0.914 octagon: 1 -5.08,-1.27; 2 -5.08,1.27; 3 -2.54,-1.27; 4 -2.54,1.27; 5 0,-1.27; 6 0,1.27; 7 2.54,-1.27; 8 2.54,1.27; 9 5.08,-1.27; 10 5.08,1.27
SOT23 = smd 1 x 1.4: 1 -0.95,-1.1; 2 0.95,-1.1; 3 0,1.1
F/CM12P = drill 1.016 pad 2.54 octagon: + 3.81,0; - -3.81,0
SOIC127P600X175-8N = smd 1.473 x 0.559: 1 -2.718,1.905; 2 -2.718,0.635; 3 -2.718,-0.635; 4 -2.718,-1.905; 5 2.718,-1.905; 6 2.718,-0.635; 7 2.718,0.635; 8 2.718,1.905
TQFP32-08 = smd 1.27 x 0.559: 1 -4.293,2.8; 2 -4.293,2; 3 -4.293,1.2; 4 -4.293,0.4; 5 -4.293,-0.4; 6 -4.293,-1.2; 7 -4.293,-2; 8 -4.293,-2.8; 17 4.293,-2.8; 18 4.293,-2; 19 4.293,-1.2; 20 4.293,-0.4; 21 4.293,0.4; 22 4.293,1.2; 23 4.293,2; 24 4.293,2.8 | smd 0.559 x 1.27: 9 -2.8,-4.293; 10 -2,-4.293; 11 -1.2,-4.293; 12 -0.4,-4.293; 13 0.4,-4.293; 14 1.2,-4.293; 15 2,-4.293; 16 2.8,-4.293; 25 2.8,4.293; 26 2,4.293; 27 1.2,4.293; 28 0.4,4.293; 29 -0.4,4.293; 30 -1.2,4.293; 31 -2,4.293; 32 -2.8,4.293

### Placement (x,y rotation side)
5V  33.02,77.22 270 top
12IN+  53.59,62.23 180 bottom
12IN-  61.21,67.31 180 bottom
12OUT+  53.59,72.39 270 bottom
12OUT-  61.21,77.47 180 bottom
12V  57.66,89.15 90 top
24IN+  53.59,41.91 90 bottom
24IN-  61.21,46.99 180 bottom
ACTU+  53.59,52.07 180 bottom
ACTU-  61.21,57.15 180 bottom
C1  30.99,44.45 90 top
C3  51.82,96.52 180 top
C4  25.91,79.76 0 top
C5  9.65,69.09 0 top
C10  3.3,73.66 90 bottom
C11  3.3,68.83 90 bottom
C12  9.65,67.06 0 top
C13  16.26,66.29 180 bottom
C14  15.75,82.55 270 bottom
C16  13.72,82.55 90 bottom
C18  43.05,95.76 90 bottom
C19  43.05,91.95 90 bottom
C20  37.97,98.04 0 bottom
C21  43.05,88.77 270 bottom
C24  4.83,60.45 180 bottom
C25  32.89,95.76 270 bottom
D1  41.27,72.39 90 bottom
D3  46.23,91.95 270 top
EXT+  53.59,82.55 270 bottom
EXT-  61.21,87.63 180 bottom
F2-0.5A  52.32,89.41 90 top
GELB  51.82,4.57 270 top
GRÜN  51.82,7.11 270 top
H5  5,95 0 top
H6  60,95 0 top
H7  5,5 0 top
H8  60,5 0 top
IC3  36.58,92.96 270 top
IC4  35.56,0.76 180 top
IC7  37.97,91.95 270 bottom
IC10  44.45,62.23 90 bottom
IC11  46.48,48.01 180 bottom
IC12  46.48,35.81 0 bottom
IC15  44.45,82.55 90 bottom
ISP  14.99,90.93 90 top
JP1  24.89,52.07 90 top
JP2  3.3,26.67 90 top
JP3  6.86,26.67 90 top
JP4  6.86,14.99 90 top
JP5  3.3,14.99 90 top
JP6  8.13,87.12 270 top
JP7  4.32,87.12 270 top
JP9  5.08,20.83 90 top
KICK  51.82,9.59 270 top
KICK+  53.59,31.75 90 bottom
KICK-  61.21,36.83 180 bottom
L1  11.43,82.55 90 bottom
L3  34.04,83.82 270 top
MOT1+  53.59,11.43 270 bottom
MOT1-  61.21,16.51 180 bottom
MOT2+  53.59,21.59 270 bottom
MOT2-  61.21,26.67 180 bottom
Q1  5.08,72.14 90 top
R1  16.26,64.01 0 bottom
R2  26.67,68.58 0 bottom
R3  26.67,68.58 180 top
R4  13.46,24.89 270 top
R5  30.73,60.96 90 top
R6  24.89,55.37 180 bottom
R7  10.92,24.89 270 top
R8  26.67,73.66 0 bottom
R9  26.67,71.12 0 bottom
R10  26.67,73.66 180 top
R11  26.67,71.12 0 top
R12  16,24.89 270 top
R13  45.47,60.96 180 top
R14  26.67,76.2 0 bottom
R15  19.56,34.54 270 top
R16  12.19,35.31 270 top
R17  14.73,35.31 270 top
R18  33.02,79.25 0 top
R19  26.67,81.28 0 bottom
R20  26.67,78.74 0 bottom
R21  45.72,83.82 180 top
R22  45.72,81.28 180 top
R23  22.1,34.54 270 top
R24  26.23,24.89 270 top
R25  46.99,4.57 0 top
R26  46.99,2.03 0 top
R27  46.99,7.11 0 top
R28  57.66,86.87 0 top
R29  46.99,9.59 0 top
R30  50.04,71.12 180 top
R31  1.52,55.12 270 bottom
R35  50.04,68.58 0 top
R36  52.58,48.51 0 top
R37  52.58,45.97 180 top
R38  52.58,35.31 0 top
R39  52.58,37.85 180 top
R40  29.21,16 270 bottom
R41  31.75,16 90 bottom
R42  52.58,32.77 180 top
R43  29.21,10.16 90 bottom
R44  52.58,51.05 180 top
R45  50.04,76.2 0 top
R46  50.04,73.66 180 top
R47  47.24,36.07 180 top
R48  34.29,16 90 bottom
R49  47.05,47.5 180 top
R50  45.47,63.5 180 top
RJ_1  10.92,43.18 270 top
RJ_2  10.92,57.4 270 top
ROT  51.82,2.03 270 top
RS232  24.64,90.93 90 top
SJ2  16.26,61.72 180 bottom
SV2  13.72,11.43 90 top
SV4  23.11,11.43 90 top
T1  34.8,60.96 270 top
T2  25.4,29.72 270 top
T5  11.94,30.73 180 top
T6  15.75,29.72 270 top
T7  20.64,29.72 270 top
TDB-05  35.81,52.07 270 top
U$1  5.33,55.12 270 bottom
U$2  12.95,73.66 90 bottom
VR6  45.47,67.56 90 top
VR7  47.24,44.2 90 top
VR8  47.24,39.37 90 top
VR9  33.02,10.41 0 bottom
VR10  45.47,72.39 90 top

### Tracks (layer width: path | path; a pad name or v marks a point on that pad's centre or on a via)
12V
  pour Bottom (rank 2, no thermals): 40.39,65.02 40.39,59.69 38.86,59.69 32.51,68.83 32.51,70.87 36.32,70.87
12VIN  (via drill 0.6)
  Top 0.254: R35.2 53.59,68.58 | 53.59,68.58 56.39,68.58 56.9,69.09 56.9,86.68 R28.1 | v53.59,66.29 53.59,68.58 | R3.1 36.07,68.58 v38.1,70.61
  Bottom 0.254: 12IN+.P$1 v53.59,66.29 | IC10.TAB 46.48,62.23 43.18,65.53 41.15,65.53 40.13,66.55 40.13,68.58 v38.1,70.61
  Bottom 3.81: 12IN+.P$1 IC10.TAB
12VOUT  (via drill 0.6)
  Top 0.254: v39.88,71.88 39.88,70.1 36.32,66.55 v28.45,66.55 | v28.45,57.15 28.45,50.29 v25.4,47.24 | v13.72,46.48 13.21,45.97 13.21,37.27 R16.1
  Top 1.016: F2-0.5A.1 48.35,86.96 v48.26,86.87
  Bottom 0.254: D1.P$3 40.39,72.39 v39.88,71.88 | v28.45,66.55 v28.45,57.15 | v25.4,47.24 14.48,47.24 v13.72,46.48
  Bottom 1.016: D1.P$3 45.72,74.93 42.93,77.72 42.93,85.85 43.43,86.36 47.75,86.36 v48.26,86.87
  pour Bottom (rank 2, no thermals): 56.13,69.85 50.29,66.55 41.15,66.55 41.15,78.23 50.29,78.23 56.13,74.93
24VIN  (via drill 0.6)
  Top 0.254: IC4.3 35.56,23.37 v31.75,19.56 | v49.78,41.91 51.56,41.91 | 51.56,41.91 51.56,37.91 R39.2 | 51.56,41.91 51.56,45.91 R37.2 | R11.2 27.62,71.31 28.96,72.64 v32.26,72.64 | v37.34,59.69 v39.62,57.4
  Bottom 0.254: v31.75,19.56 R41.2 | 24IN+.P$1 v49.78,41.91 | v32.26,72.64 32.26,71.88 32,71.63 32,65.02 v37.34,59.69 | v39.62,57.4 39.62,52.36 IC11.TAB
  pour Bottom (rank 2, no thermals): 56.13,44.45 49.28,48.77 43.69,48.77 34.04,33.02 34.04,30.48 34.8,29.72 36.32,29.72 39.88,33.27 43.69,35.05 49.28,35.05 56.13,39.37
+5V  (via drill 0.6)
  Top 0.254: T7.3 T6.3 12.02,29.72 T5.3 | T7.3 T2.3 26.67,29.72 v26.67,32 | SV4.10 21.84,29.21 21.74,29.32 T7.3 | L3.2 31.99,81.23 R18.2 | v12.7,67.56 10.53,67.56 | C12.2 10.53,67.56 | 10.53,67.56 C5.2 10.53,68.19 10.41,68.07 2.03,68.07 | C12.2 10.41,67.06 | C12.2 10.53,66.92 v8.89,65.28 | v9.78,83.19 9.02,83.19 8.89,83.06
  Top 0.406: TDB-05.+ 35.81,45.97 35.31,45.47 30.99,45.47 | 30.99,45.47 v29.21,45.47 | C1.2 30.99,45.47 | v2.03,50.04 2.03,68.07
  Top 0.61: 29.46,83.82 v29.46,94.23 IC3.3 | 28.31,83.55 10.15,83.55 v9.78,83.19 9.65,83.06 8.89,83.06 6.1,83.06 2.03,78.99 2.03,68.07
  Top 0.813: C4.+ 28.31,83.55 28.57,83.82 29.46,83.82 L3.2
  Bottom 0.254: IC7.16 33.13,96.39 | 33.13,96.39 C25.1 | ISP.2 11.94,88.39 11.43,87.88 L1.2 | 33.13,96.39 29.84,96.39 29.46,96.01 v29.46,94.23 | L1.2 11.36,83.5 | 5.7,60.48 C24.2 | U$1.3 5.97,60.16 C24.2 | U$2.4 13.35,68.22 v12.7,67.56 12.7,64.26 12.95,64.01 R1.2 15.49,63.82 SJ2.1 | C24.2 5.68,62.06 v8.89,65.28 | L1.2 10.09,83.5 v9.78,83.19 | v26.67,32 26.67,32.51 29.21,35.05 v29.21,45.47
  Bottom 0.406: SV2.10 SV2.9 SV4.10 SV4.9 | v29.21,45.47 24.89,49.78 2.29,49.78 v2.03,50.04
ADC2  (via drill 0.6)
  Top 0.254: R9.2 v24.13,71.12 17.53,71.12 12.95,75.69 11.68,75.69 10.92,74.93 10.92,74.68 v10.16,73.91
  Bottom 0.254: v24.13,71.12 R9.2 | U$2.13 10.01,74.06 v10.16,73.91
ADC3  (via drill 0.6)
  Top 0.254: R13.2 41.66,60.96 41.4,61.21 v41.4,63.25 24.64,63.25 13.72,74.17 v11.68,74.17
  Bottom 0.254: IC10.IS 41.28,63.37 v41.4,63.25 | U$2.14 10.99,74.86 v11.68,74.17
ADC5  (via drill 0.6)
  Top 0.254: v45.21,28.96 45.21,34.29 43.94,35.56 32.51,35.56 v32,36.07 | v7.62,81.53 8.38,82.3 19.81,82.3 20.32,81.79 20.32,78.99 23.11,76.2 v24.13,76.2
  Bottom 0.254: IC12.IS 45.34,29.09 v45.21,28.96 | v32,36.07 32,61.21 29.72,63.5 29.72,74.42 29.21,74.93 26.99,74.93 R14.2 v24.13,76.2 | v7.62,81.53 7.62,76.71 7.87,76.45 U$2.16
ADC6
  Bottom 0.254: IC4.4 33.02,61.21 30.48,63.75 30.48,76.96 29.97,77.47 26.99,77.47 R20.2 21.84,78.74 21.59,78.49 21.59,75.95 21.3,75.66 U$2.26
ADC7  (via drill 0.6)
  Top 0.254: R21.2 41.4,83.82 v41.27,83.69 39.62,82.04 39.62,75.44 39.12,74.93 v23.37,74.93
  Bottom 0.254: v41.27,83.69 IC15.IS | U$2.27 23.3,74.86 v23.37,74.93
ADC8  (via drill 0.6)
  Top 0.254: v24.13,68.58 R2.2 | v9.14,79.25 10.67,77.72 11.68,77.72 17.27,72.14 v22.86,72.14
  Bottom 0.254: R2.2 v24.13,68.58 23.37,68.58 22.86,69.09 v22.86,72.14 | U$2.17 10.15,78.24 v9.14,79.25
ADC9  (via drill 0.6)
  Top 0.254: R10.2 v24.13,73.66 22.86,73.66 22.1,72.9 17.27,72.9 v10.67,79.5
  Bottom 0.254: v24.13,73.66 R10.2 | U$2.18 10.95,79.22 v10.67,79.5
ADC10
  Bottom 0.254: IC11.IS 47.62,58.04 47.24,58.42 36.83,58.42 31.24,64.01 31.24,79.5 30.73,80.01 26.99,80.01 R19.2 25.65,81.28 23.88,79.5 14.48,79.5 14.15,79.18 U$2.22
AKTUATOR  (via drill 0.6)
  Top 0.254: R17.1 14.92,36.26 15.75,37.08 18.54,37.08 24.38,42.93 26.16,42.93 26.67,42.42 41.66,42.42 43.18,43.94 v43.18,54.61
  Bottom 0.254: v43.18,54.61 43.94,54.61 44.2,54.36 IC11.OUT1
  Bottom 0.813: 52.86,52.81 ACTU+.P$1
  pour Bottom (rank 2, no thermals): 43.81,50.16 43.81,53.59 44.58,53.59 44.58,51.69 48.39,51.69 48.39,53.59 49.4,54.61 56.13,54.61 56.13,49.53 44.45,49.53
CANH
  Top 0.254: RJ_2.P$3 17.47,46.94 16.51,45.97 16.51,43.19 RJ_1.P$3
  Bottom 0.254: U$1.7 4.7,55.24 5.08,55.63 8.13,55.63 8.95,56.45 RJ_2.P$3 17.66,56.64 21.08,56.64 22.35,55.37 R6.1
CANL  (via drill 0.6)
  Top 0.254: RJ_1.P$2 23.05,44.13 23.62,44.7 JP1.2 v23.62,57.66
  Bottom 0.254: JP1.2 23.62,51.31 23.11,50.8 6.35,50.8 5.97,51.18 U$1.6 | v23.62,57.66 22.86,58.42 20.08,58.42 RJ_2.P$2
EXT
  pour Bottom (rank 2, no thermals): 32.51,73.91 32.51,75.95 38.86,85.09 40.39,85.09 40.39,79.76 36.07,73.91
EXTIN  (via drill 0.6)
  Top 0.254: v53.59,78.49 53.59,76.71 53.09,76.2 R45.2 | R10.1 39.37,73.66 v44.7,78.99
  Bottom 0.254: EXT+.P$1 v53.59,78.49 | v44.7,78.99 46.74,81.03 46.74,82.34 IC15.TAB
  Bottom 3.81: EXT+.P$1 IC15.TAB
GND  (via drill 0.6)
  Bottom 0.254: IC7.8 42.66,87.5 C21.2 | C20.2 37.08,98.03 37.08,95.5 36.7,95.12 IC7.15 34.66,94.88 C25.2
  other vias: 12.95,80.26 10.67,71.37 24.38,66.04 19.3,78.23 30.35,78.23 29.34,76.2 37.85,51.94 42.67,57.02 23.11,23.24 17.02,69.47
  pour Bottom (rank 2, no thermals): 58.67,90.17 63.75,90.17 63.75,13.97 58.67,13.97
  pour Bottom (rank 6): 0,99.82 65.28,99.82 65.28,0 0,0
  pour Top (rank 6): 0,99.82 65.28,99.82 65.28,0 0,0
ICLED_AKT  (via drill 0.6)
  Top 0.254: R25.1 40.89,4.57 25.78,19.68 v25.53,19.68 | v14.99,19.68 14.73,19.94 14.73,24.57 R4.1 13.21,26.1 v13.21,27.69 14.29,28.77 T6.2 | v18.54,66.8 16,64.26 16,40.89 17.27,39.62 v17.27,39.12
  Bottom 0.254: v25.53,19.68 v14.99,19.68 | v13.21,27.69 17.27,31.75 v17.27,39.12 | U$2.30 18.47,72.46 19.05,71.88 19.05,67.31 v18.54,66.8
ICLED_GRUEN  (via drill 0.6)
  Top 0.254: R27.1 40.13,7.11 v25.91,21.34 | 19.54,28.68 19.28,28.68 | 16,25.91 16.51,25.91 v18.29,27.69 19.28,28.68 | 16,25.91 15.81,25.91 | 19.28,28.68 19.37,28.77 T7.2 | v18.29,38.1 18.29,39.62 19.05,40.39 19.05,64.01 v20.57,65.53 | v19.81,21.34 18.54,22.61 18.54,23.62 16.32,25.84 R12.1 16,25.91
  Bottom 0.254: v25.91,21.34 v19.81,21.34 | U$2.28 20.17,74.06 20.57,73.66 v20.57,65.53 | v18.29,27.69 v18.29,38.1
ICLED_KICK  (via drill 0.6)
  Top 0.254: R29.1 38.92,9.59 28.19,20.32 28.19,23.87 R24.1 26.23,26.84 T2.2 24.2,28.77 v23.11,27.69 | v14.73,71.88 v14.73,43.18
  Bottom 0.254: v23.11,27.69 19.3,31.5 19.3,38.61 v14.73,43.18 | U$2.24 15.75,77.22 14.73,76.2 v14.73,71.88
ICLED_ROT  (via drill 0.6)
  Top 0.254: v24.38,18.29 25.65,18.29 41.91,2.03 R26.1 | v12.19,20.57 12.19,24.89 11.24,25.84 R7.1 10.99,25.91 T5.2 10.84,31.83 7.37,35.31 7.37,63.5 7.87,64.01 10.67,64.01 13.72,67.06 v13.72,72.9
  Bottom 0.254: v12.19,20.57 14.48,18.29 v24.38,18.29 | U$2.23 14.95,77.18 13.72,75.95 v13.72,72.9
KICKER  (via drill 0.6)
  Top 0.254: v44.2,33.53 43.18,34.54 28.38,34.54 27.43,35.49 R23.1
  Bottom 0.254: v44.2,33.53 IC12.OUT2
  pour Bottom (rank 2, no thermals): 43.81,30.23 43.81,33.53 44.58,34.29 56.13,34.29 56.13,29.21 49.4,29.21 48.39,30.23 48.39,32.13 44.58,32.13 44.58,30.23
LED_GELB
  Top 0.254: SV2.5 13.72,12.7 13.72,21.08 13.46,21.34 R4.2
LED_GRUEN
  Top 0.254: R12.2 16,19.81 16.51,19.3 16.51,15.49 SV2.7
LED_KICK
  Top 0.254: R24.2 23.11,20.83 23.11,15.24 SV4.7
LED_ROT
  Top 0.254: SV2.3 13.72,10.16 11.43,10.16 10.92,10.67 R7.2
MISO  (via drill 0.6)
  Top 0.254: v18.03,80.52 18.03,78.74 v17.53,78.23
  Bottom 0.254: ISP.1 18.03,86.61 v18.03,80.52 | v17.53,78.23 15.75,76.45 U$2.1
MOSI
  Bottom 0.254: JP7.1 4.32,90.68 4.57,90.93 ISP.4
MOTION
  Top 0.254: R15.1 20.51,34.54 27.18,34.54 IC4.5
  pour Bottom (rank 3, no thermals): 56.13,8.89 56.13,24.13 51.05,24.13 44.2,27.18 42.16,32 41.4,32.77 39.88,32.77 39.12,32 39.12,27.94 38.61,27.43 32.51,27.43 32,27.94 32,32 31.24,32.77 29.72,32.77 28.96,32 28.96,24.38 51.05,8.89
N$1
  Top 0.254: R5.2 T1.1
N$2
  Top 0.254: RJ_1.P$1 17.47,45.16 18.54,46.23 18.54,58.24 RJ_2.P$1
  Bottom 0.254: RJ_2.P$1 17.47,61.27 SJ2.2
N$3  (via drill 0.6)
  Top 0.254: R22.2 41.4,81.28 v41.27,81.41
  Bottom 0.254: v41.27,81.41 IC15.IN
N$4
  Top 0.254: R23.2 22.1,30.99 22.42,30.67 T2.1
N$5
  Top 0.254: KICK.A R29.2
N$6
  Bottom 0.254: U$1.8 1.96,52.4 1.52,52.83 R31.2
N$7
  Bottom 0.254: JP1.1 26.16,55.05 R6.2
N$8
  Top 0.254: R25.2 GELB.A
N$9
  Top 0.254: R26.2 ROT.A
N$10
  Bottom 0.254: C10.2 3.32,74.55 Q1.2 5.08,73.41 6.03,72.46 U$2.11
N$11
  Bottom 0.254: C11.2 5.07,69.71 Q1.1 5.08,70.87 5.87,71.66 U$2.10
N$12  (via drill 0.6)
  Top 0.254: v24.89,41.4 45.21,41.4 46.14,42.33 VR7.3
  Bottom 0.254: v24.89,41.4 24.38,40.89 24.38,26.42 23.88,25.91 10.92,25.91 8.64,28.19 4.83,28.19 JP2.2
N$13
  Bottom 0.254: U$2.21 13.35,79.14 14.73,80.52 14.73,81.53 14.87,81.67 C14.2
N$14
  Bottom 0.254: U$2.19 11.75,79.69 11.43,80.01 L1.1 11.51,81.67 C16.1
N$15
  Bottom 0.254: IC7.1 42.81,96.39 C18.2
N$16
  Bottom 0.254: JP6.2 6.6,87.12 6.1,86.61 6.1,80.01 6.86,79.25 6.86,73.66 7.26,73.26 U$2.12
N$17  (via drill 0.6)
  Top 0.254: v10.92,76.45 6.1,76.45 v4.06,78.49
  Bottom 0.254: U$2.2 14.95,70.39 12.7,72.64 12.7,76.2 12.45,76.45 v10.92,76.45 | v4.06,78.49 2.29,80.26 2.29,85.09 JP7.2
N$18
  Bottom 0.254: IC7.4 42.81,92.58 C19.2
N$19
  Bottom 0.254: VR9.3 33.02,8.38 29.46,4.83 11.43,4.83 5.08,11.18 5.08,13.21 JP4.2
N$20
  Top 0.254: T1.3 35.9,55.96 TDB-05.-
N$21
  Top 0.254: R27.2 GRÜN.A
N$22
  Top 0.61: IC3.10 47.24,91.69 47.41,91.86 F2-0.5A.2 52.32,94.23 50.04,96.52 C3.+
N$23  (via drill 0.6)
  Top 0.254: VR8.3 v25.65,39.37
  Bottom 0.254: v25.65,39.37 25.15,38.86 25.15,25.4 24.64,24.89 8.64,24.89 JP3.2
N$24
  Top 0.254: R28.2 58.61,89.05 12V.A
N$25  (via drill 0.6)
  Top 0.254: R22.1 46.67,76.64 45.47,75.44 45.47,68.66 VR6.3 39.62,67.56 37.08,65.02 27.18,65.02 v26.92,64.77 | v1.02,48.26 1.02,15.49 1.52,14.99 JP5.2 | v26.92,58.67 26.92,56.13 27.43,55.63 27.43,50.8 25.15,48.51 v24.64,48.51
  Bottom 0.254: v26.92,64.77 v26.92,58.67 | v24.64,48.51 1.27,48.51 v1.02,48.26
N$28  (via drill 0.6)
  Top 0.254: v42.93,63.5 R50.2
  Bottom 0.254: IC10.IN 42.04,61.09 42.42,61.47 42.42,62.99 v42.93,63.5
N$33
  Top 0.254: VR6.2 49.02,68.51 R35.1 R30.2 47.14,71.12 46.82,71.44 VR10.1
N$35
  Bottom 0.254: C18.1 43.05,94.11 42.8,93.85 IC7.3
N$36
  Bottom 0.254: IC7.5 42.81,91.31 C19.1
N$37
  Bottom 0.254: IC7.2 39.24,95.12 38.86,95.5 38.86,98.03 C20.1
N$38
  Bottom 0.254: IC7.6 42.66,90.04 C21.1
N$39
  Top 0.254: VR7.1 48.19,43.25 47.24,44.2 47.24,46.74 R49.1
N$40
  Bottom 0.254: IC7.13 27.56,92.58 RS232.3
N$41
  Bottom 0.254: IC7.7 39.24,88.77 36.07,85.6 28.7,85.6 RS232.1
N$42
  Top 0.254: R37.1 53.53,47.24 | 53.53,47.24 R36.2 | VR7.2 49.72,45.15 50.04,45.47 50.04,46.99 50.29,47.24 53.53,47.24
N$43  (via drill 0.6)
  Top 0.254: R47.2 46.29,29.4 v46.74,28.96
  Bottom 0.254: IC12.IN 47.62,29.33 47.24,28.96 v46.74,28.96
N$44
  Top 0.254: R38.2 53.53,36.58 | 53.53,36.58 R39.1 | VR8.2 49.85,40.32 50.04,40.13 50.04,36.83 50.29,36.58 53.53,36.58
N$45
  Bottom 0.254: R40.2 R41.1 31.75,12.95 32.07,12.63 VR9.2
N$46  (via drill 0.6)
  Top 0.254: IC4.2 v38.1,15.49
  Bottom 0.254: v38.1,15.49 37.59,14.99 36.58,14.99 36.07,15.49 36.07,16.51 35.63,16.95 R48.2
N$47
  Top 0.254: R42.2 R38.1
N$48
  Bottom 0.254: R40.1 27.87,16.95 27.69,16.76 27.69,11.43 28.01,11.11 R43.2
N$49
  Top 0.254: R44.2 R36.1
N$50
  Top 0.254: VR10.2 46.89,73.66 R46.2 R45.1
N$51
  Top 0.254: R47.1 48.19,38.27 VR8.1
N$52
  Bottom 0.254: VR9.1 33.97,12.63 34.29,12.95 R48.1
N$53  (via drill 0.6)
  Top 0.254: R49.2 46.1,54.99 45.97,55.12 v45.72,55.12
  Bottom 0.254: IC11.IN 45.34,54.74 v45.72,55.12
N$54
  Top 0.254: VR6.1 46.57,63.65 R50.1
N$64
  Top 0.61: D3.C 46.14,94.23 IC3.12 36.58,94.23 36.07,93.73 36.07,83.84 L3.1
N$102
  Top 0.254: T5.1 12.89,32.07 12.19,32.77 R16.2
N$104
  Top 0.254: R17.2 14.73,30.75 T6.1
N$106
  Top 0.254: R15.2 19.56,30.69 T7.1
N$108
  Top 0.254: R18.1 32.07,77.32 5V.A
RST
  Bottom 0.254: U$2.31 18.26,71.66 18.54,71.37 18.54,69.6 17.13,68.19 C13.2 17.13,64.08 R1.1
RXCAN
  Bottom 0.254: U$2.7 10.95,65.06 7.24,61.34 U$1.4
RXD  (via drill 0.6)
  Top 0.254: JP6.3 v23.37,84.58
  Bottom 0.254: IC7.12 29.08,91.31 27.43,89.66 25.15,89.66 24.64,89.15 24.64,85.09 24.13,84.58 v23.37,84.58
SCK
  Bottom 0.254: ISP.3 14.99,89.66 JP6.1
SPEAKER  (via drill 0.6)
  Top 0.254: v23.11,59.94 30.67,59.94 R5.1
  Bottom 0.254: U$2.29 19.45,73.26 19.56,73.15 19.56,60.45 20.07,59.94 v23.11,59.94
SW_1  (via drill 0.6)
  Top 0.254: v9.65,34.8 8.89,35.56 8.89,62.74 9.4,63.25 11.68,63.25 v13.72,65.28 | v9.65,29.97 9.65,13.21 v9.91,12.95
  Bottom 0.254: U$2.3 14.15,65.72 v13.72,65.28 | v9.65,34.8 v9.65,29.97 | SV4.6 20.57,12.7 10.16,12.7 v9.91,12.95
SW_12V  (via drill 0.6)
  Top 0.254: JP5.1 3.3,9.4 3.81,8.89 SV2.4 | v8.89,77.72 6.86,77.72 v5.84,78.74 | v3.05,65.53 3.05,47.5 v2.54,46.99
  Bottom 0.254: U$2.15 9.62,75.66 9.91,75.95 9.91,76.71 v8.89,77.72 | v5.84,78.74 4.32,77.22 2.54,77.22 2.03,76.71 2.03,66.55 v3.05,65.53 | v2.54,46.99 1.27,45.72 1.27,14.48 JP5.1
SW_AKT  (via drill 0.6)
  Top 0.254: v8.64,11.43 5.33,11.43 5.08,11.68 5.08,19.3 3.81,20.57 JP9.2 3.81,22.86 3.3,23.37 JP2.1 1.52,25.91 1.52,43.69 4.32,46.48 v4.32,63.25
  Bottom 0.254: v8.64,11.43 SV2.6 | U$2.8 10.15,68.07 9.14,67.06 8.13,67.06 v4.32,63.25
SW_KICK  (via drill 0.6)
  Top 0.254: JP9.1 6.35,22.86 6.86,23.37 JP3.1 5.59,24.13 5.08,24.64 5.08,31.75 3.81,33.02 3.81,43.94 v4.06,44.2 | v18.8,76.96 20.57,76.96 21.59,75.95 v21.59,73.91 | v21.08,46.23 21.59,46.74 v21.59,64.01
  Bottom 0.254: SV4.8 19.3,13.97 18.03,15.24 11.68,15.24 11.18,15.75 11.18,20.32 10.67,20.83 JP9.1 | U$2.25 18.29,76.46 v18.8,76.96 | v21.59,73.91 v21.59,64.01 | v21.08,46.23 16.26,46.23 14.99,44.96 4.83,44.96 v4.06,44.2
SW_MOT  (via drill 0.6)
  Top 0.254: v5.59,66.55 5.59,33.78 8.64,30.73 8.64,14.22 JP4.1
  Bottom 0.254: SV2.8 8.38,13.97 JP4.1 | U$2.9 8.38,70.86 5.59,68.07 v5.59,66.55
TXCAN
  Bottom 0.254: U$2.6 11.75,64.59 8.13,60.96 8.13,56.9 7.62,56.39 3.81,56.39 3.43,56.77 U$1.1
TXD  (via drill 0.6)
  Top 0.254: v28.19,88.39 25.65,85.85 4.57,85.85 4.32,85.6 JP7.3
  Bottom 0.254: IC7.10 28.57,88.77 v28.19,88.39

### Text on the board
tNames: PowerSwitch-002 | Carpe Noctem 2015
Document: Speaker